# Altium schematic sheet stm32_mcu.SchDoc: STM32 Pin Out and Decoupling
size B; Author: Jonathan Lin; Engineer: Jonathan Lin; Revision: 1; SheetNumber: 3; SheetTotal: 3
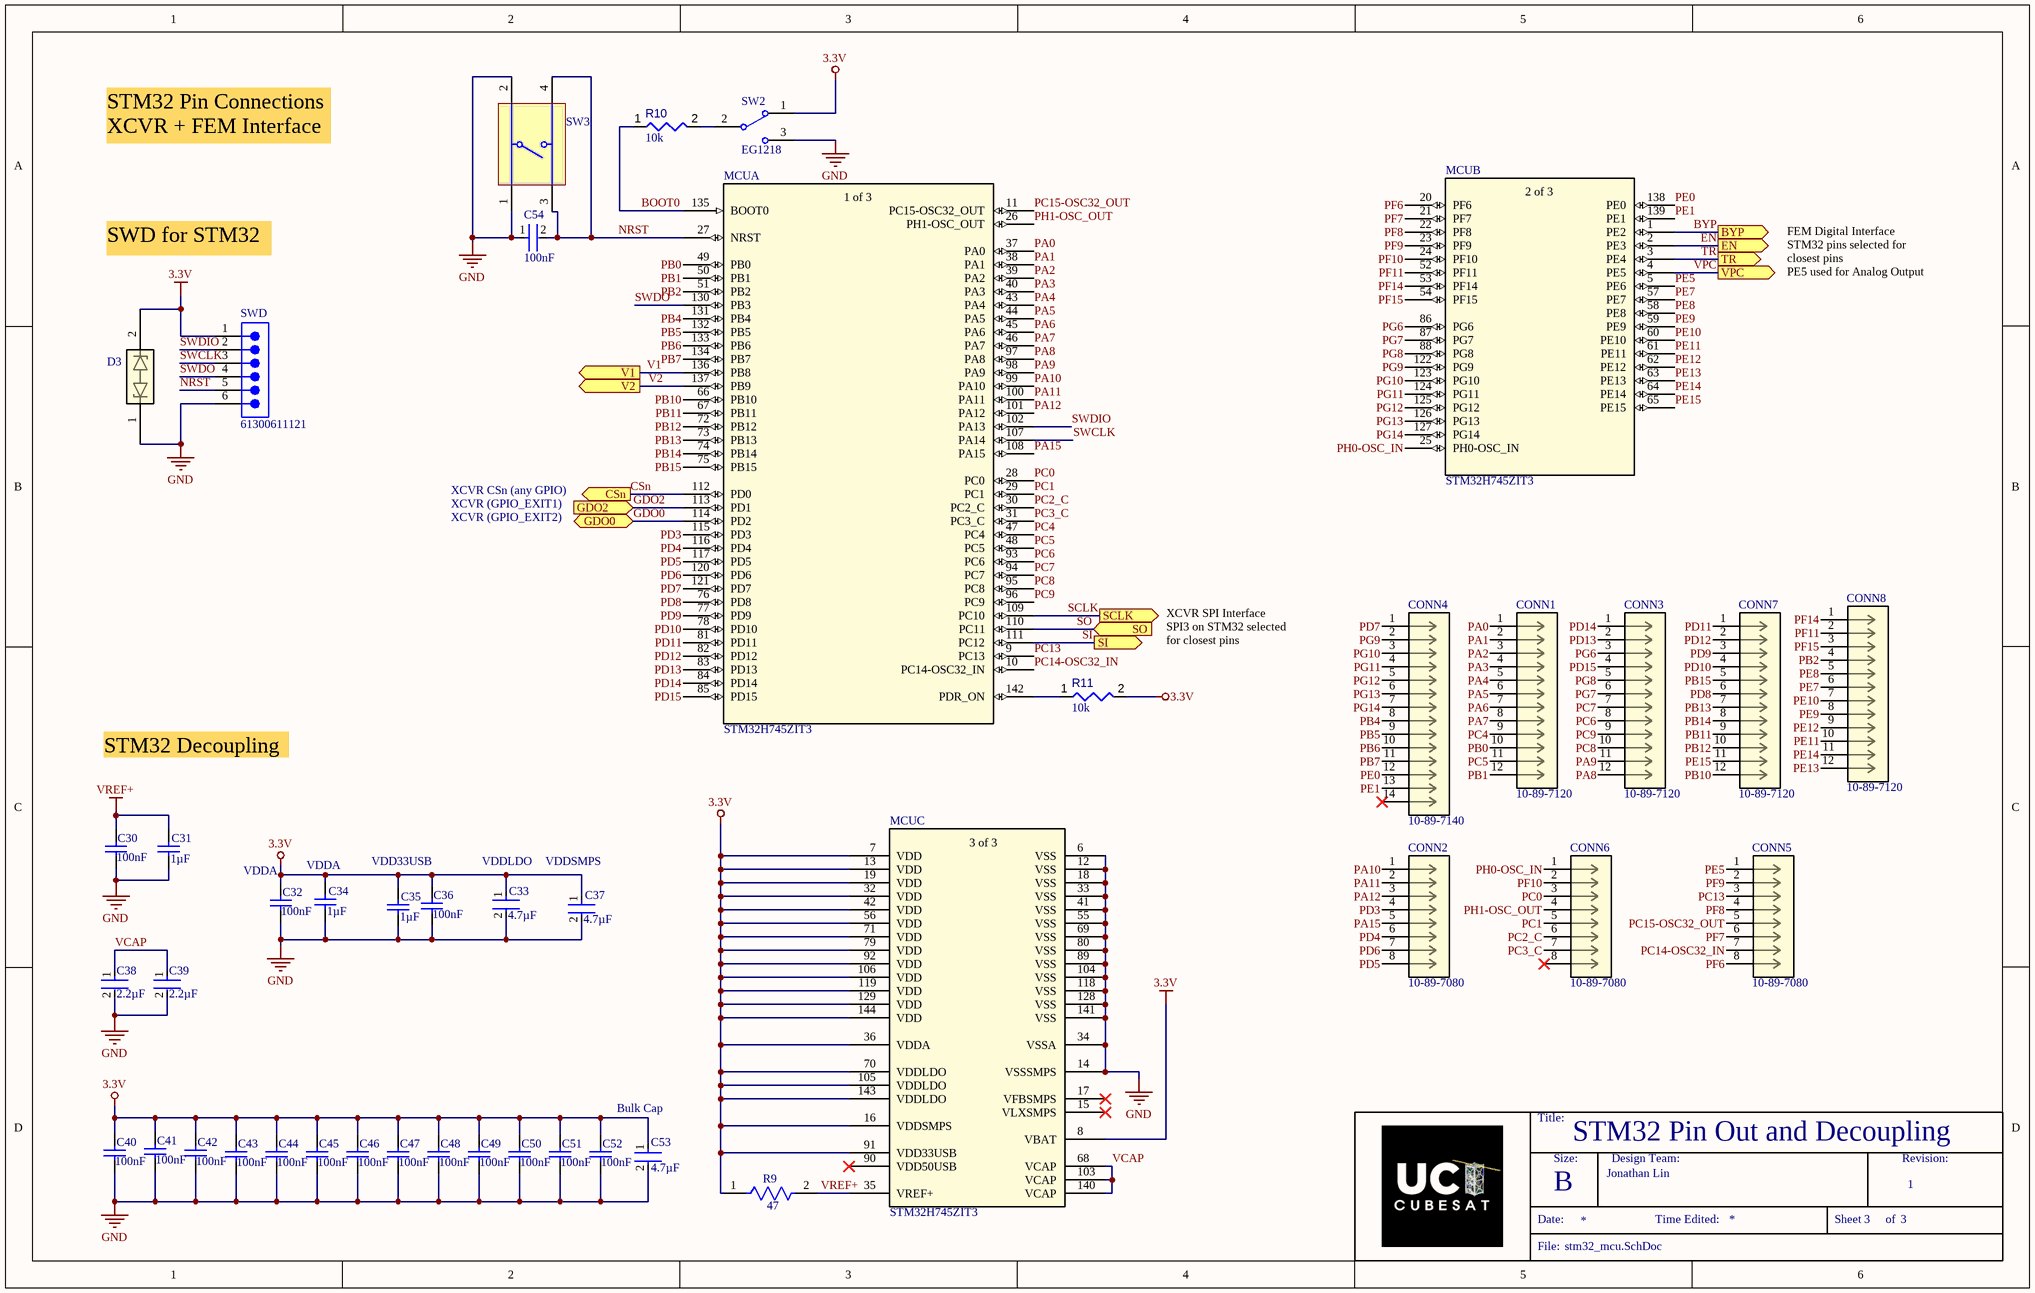
[diagram p0: stm32_mcu.SchDoc]

## Parts
C30  value 100nF  [CAPC2013X135X45ML10T25]  (hidden comment: GRM21BR72A104KAC4L)
C31  value 1µF  [CAPC2013X135X45LL10T25]  (hidden comment: GRM21BR71C105KA01L)
C32  value 100nF  [CAPC2013X135X45ML10T25]  (hidden comment: GRM21BR72A104KAC4L)
C33  value 4.7µF  [FP-GRM21B-0_2-e0_2_0_7-MFG]  (hidden comment: GRM21BZ7YA475KE15K)
C34  value 1µF  [CAPC2013X135X45LL10T25]  (hidden comment: GRM21BR71C105KA01L)
C35  value 1µF  [CAPC2013X135X45LL10T25]  (hidden comment: GRM21BR71C105KA01L)
C36  value 100nF  [CAPC2013X135X45ML10T25]  (hidden comment: GRM21BR72A104KAC4L)
C37  value 4.7µF  [FP-GRM21B-0_2-e0_2_0_7-MFG]  (hidden comment: GRM21BZ7YA475KE15K)
C38  value 2.2µF  [FP-GRM21B-0_15-IPC_A]  (hidden comment: GRM21BR71E225KE11L)
C39  value 2.2µF  [FP-GRM21B-0_15-IPC_A]  (hidden comment: GRM21BR71E225KE11L)
C40  value 100nF  [CAPC2013X135X45ML10T25]  (hidden comment: GRM21BR72A104KAC4L)
C41  value 100nF  [CAPC2013X135X45ML10T25]  (hidden comment: GRM21BR72A104KAC4L)
C42  value 100nF  [CAPC2013X135X45ML10T25]  (hidden comment: GRM21BR72A104KAC4L)
C43  value 100nF  [CAPC2013X135X45ML10T25]  (hidden comment: GRM21BR72A104KAC4L)
C44  value 100nF  [CAPC2013X135X45ML10T25]  (hidden comment: GRM21BR72A104KAC4L)
C45  value 100nF  [CAPC2013X135X45ML10T25]  (hidden comment: GRM21BR72A104KAC4L)
C46  value 100nF  [CAPC2013X135X45ML10T25]  (hidden comment: GRM21BR72A104KAC4L)
C47  value 100nF  [CAPC2013X135X45ML10T25]  (hidden comment: GRM21BR72A104KAC4L)
C48  value 100nF  [CAPC2013X135X45ML10T25]  (hidden comment: GRM21BR72A104KAC4L)
C49  value 100nF  [CAPC2013X135X45ML10T25]  (hidden comment: GRM21BR72A104KAC4L)
C50  value 100nF  [CAPC2013X135X45ML10T25]  (hidden comment: GRM21BR72A104KAC4L)
C51  value 100nF  [CAPC2013X135X45ML10T25]  (hidden comment: GRM21BR72A104KAC4L)
C52  value 100nF  [CAPC2013X135X45ML10T25]  (hidden comment: GRM21BR72A104KAC4L)
C53  value 4.7µF  [FP-GRM21B-0_2-e0_2_0_7-MFG]  (hidden comment: GRM21BZ7YA475KE15K)
C54  value 100nF  [FP-C0805C-DN-IPC_A]  (hidden comment: C0805C104K5RACTU)
CONN1  10-89-7120  [CONN12_0010897120_MOL]
CONN2  10-89-7080  [CONN08_0010897080_MOL]
CONN3  10-89-7120  [CONN12_0010897120_MOL]
CONN4  10-89-7140  [CONN14_0010897140_MOL]
CONN5  10-89-7080  [CONN08_0010897080_MOL]
CONN6  10-89-7080  [CONN08_0010897080_MOL]
CONN7  10-89-7120  [CONN12_0010897120_MOL]
CONN8  10-89-7120  [CONN12_0010897120_MOL]
D3  PESD3V3Z1BCSFYL  [SOD962-2_DSN0603-2_NEX]  (value not drawn)
MCU  STM32H745ZIT3  [LQFP-144]  (parts A,B,C of 3)
R9  value 47  [FP-RMCF1206-IPC_B]  (hidden comment: RMCF1206JT47R0)
R10  value 10k  [RESC3216X60X45ML15T20]  (hidden comment: RC0805FR-0710KL)
R11  value 10k  [RESC3216X60X45ML15T20]  (hidden comment: Resistor 10k +/-1% 1206 250 mW)
SW2  EG1218  [ESWI-EG1218_V]
SW3  1825910-6 Tact Switch  [TECO-1825910-6_V]  (value not drawn)
SWD  61300611121  [61300611121]

## Ports
BYP (out, see jlin_transceiver_prototype[2C]), CSn (out, see jlin_transceiver_prototype[1B]), EN (out, see jlin_transceiver_prototype[2C]), GDO0 (bidir, see jlin_transceiver_prototype[1B]), GDO2 (in, see jlin_transceiver_prototype[1B]), SCLK (out, see jlin_transceiver_prototype[1A]), SI (out, see jlin_transceiver_prototype[2A]), SO (in, see jlin_transceiver_prototype[1A]), TR (out, see jlin_transceiver_prototype[2C]), V1 (out, see jlin_transceiver_prototype[5A]), V2 (out, see jlin_transceiver_prototype[5A]), VPC (out, see jlin_transceiver_prototype[1C])

## Nets
3.3V: C32.2 C33.1 C34.2 C35.2 C36.2 C37.1 C40.2 C41.2 C42.2 C43.2 C44.2 C45.2 C46.2 C47.2 C48.2 C49.2 C50.2 C51.2 C52.2 C53.1 D3.2 MCU.7(VDD) MCU.8(VBAT) MCU.13(VDD) MCU.16(VDDSMPS) MCU.19(VDD) MCU.32(VDD) MCU.36(VDDA) MCU.42(VDD) MCU.56(VDD) MCU.70(VDDLDO) MCU.71(VDD) MCU.79(VDD) MCU.91(VDD33USB) MCU.92(VDD) MCU.105(VDDLDO) MCU.106(VDD) MCU.119(VDD) MCU.129(VDD) MCU.143(VDDLDO) MCU.144(VDD) R9.1 R11.2 SW2.1 SWD.1
GND: C30.1 C31.1 C32.1 C33.2 C34.1 C35.1 C36.1 C37.2 C38.2 C39.2 C40.1 C41.1 C42.1 C43.1 C44.1 C45.1 C46.1 C47.1 C48.1 C49.1 C50.1 C51.1 C52.1 C53.2 C54.1 D3.1 MCU.6(VSS) MCU.12(VSS) MCU.14(VSSSMPS) MCU.18(VSS) MCU.33(VSS) MCU.34(VSSA) MCU.41(VSS) MCU.55(VSS) MCU.69(VSS) MCU.80(VSS) MCU.89(VSS) MCU.104(VSS) MCU.118(VSS) MCU.128(VSS) MCU.141(VSS) SW2.3 SW3.1 SW3.2 SWD.6
VREF+: C30.2 C31.2 MCU.35(VREF+) R9.2
BOOT0: MCU.135(BOOT0) R10.1
BYP: MCU.1(PE2) ; port BYP
CSn: MCU.112(PD0) ; port CSn
EN: MCU.2(PE3) ; port EN
GDO0: MCU.114(PD2) ; port GDO0
GDO2: MCU.113(PD1) ; port GDO2
NRST: C54.2 MCU.27(NRST) SW3.3 SW3.4 SWD.5
PA0: CONN1.1 MCU.37(PA0)
PA1: CONN1.2 MCU.38(PA1)
PA2: CONN1.3 MCU.39(PA2)
PA3: CONN1.4 MCU.40(PA3)
PA4: CONN1.5 MCU.43(PA4)
PA5: CONN1.6 MCU.44(PA5)
PA6: CONN1.7 MCU.45(PA6)
PA7: CONN1.8 MCU.46(PA7)
PA8: CONN3.12 MCU.97(PA8)
PA9: CONN3.11 MCU.98(PA9)
PA10: CONN2.1 MCU.99(PA10)
PA11: CONN2.2 MCU.100(PA11)
PA12: CONN2.3 MCU.101(PA12)
PA15: CONN2.5 MCU.108(PA15)
PB0: CONN1.10 MCU.49(PB0)
PB1: CONN1.12 MCU.50(PB1)
PB2: CONN8.4 MCU.51(PB2)
PB4: CONN4.8 MCU.131(PB4)
PB5: CONN4.9 MCU.132(PB5)
PB6: CONN4.10 MCU.133(PB6)
PB7: CONN4.11 MCU.134(PB7)
PB10: CONN7.12 MCU.66(PB10)
PB11: CONN7.9 MCU.67(PB11)
PB12: CONN7.10 MCU.72(PB12)
PB13: CONN7.7 MCU.73(PB13)
PB14: CONN7.8 MCU.74(PB14)
PB15: CONN7.5 MCU.75(PB15)
PC0: CONN6.3 MCU.28(PC0)
PC1: CONN6.5 MCU.29(PC1)
PC2_C: CONN6.6 MCU.30(PC2_C)
PC3_C: CONN6.7 MCU.31(PC3_C)
PC4: CONN1.9 MCU.47(PC4)
PC5: CONN1.11 MCU.48(PC5)
PC6: CONN3.8 MCU.93(PC6)
PC7: CONN3.7 MCU.94(PC7)
PC8: CONN3.10 MCU.95(PC8)
PC9: CONN3.9 MCU.96(PC9)
PC13: CONN5.3 MCU.9(PC13)
PC14-OSC32_IN: CONN5.7 MCU.10(PC14-OSC32_IN)
PC15-OSC32_OUT: CONN5.5 MCU.11(PC15-OSC32_OUT)
PD3: CONN2.4 MCU.115(PD3)
PD4: CONN2.6 MCU.116(PD4)
PD5: CONN2.8 MCU.117(PD5)
PD6: CONN2.7 MCU.120(PD6)
PD7: CONN4.1 MCU.121(PD7)
PD8: CONN7.6 MCU.76(PD8)
PD9: CONN7.3 MCU.77(PD9)
PD10: CONN7.4 MCU.78(PD10)
PD11: CONN7.1 MCU.81(PD11)
PD12: CONN7.2 MCU.82(PD12)
PD13: CONN3.2 MCU.83(PD13)
PD14: CONN3.1 MCU.84(PD14)
PD15: CONN3.4 MCU.85(PD15)
PE0: CONN4.12 MCU.138(PE0)
PE1: CONN4.13 MCU.139(PE1)
PE5: CONN5.1 MCU.5(PE6)
PE7: CONN8.6 MCU.57(PE7)
PE8: CONN8.5 MCU.58(PE8)
PE9: CONN8.8 MCU.59(PE9)
PE10: CONN8.7 MCU.60(PE10)
PE11: CONN8.10 MCU.61(PE11)
PE12: CONN8.9 MCU.62(PE12)
PE13: CONN8.12 MCU.63(PE13)
PE14: CONN8.11 MCU.64(PE14)
PE15: CONN7.11 MCU.65(PE15)
PF6: CONN5.8 MCU.20(PF6)
PF7: CONN5.6 MCU.21(PF7)
PF8: CONN5.4 MCU.22(PF8)
PF9: CONN5.2 MCU.23(PF9)
PF10: CONN6.2 MCU.24(PF10)
PF11: CONN8.2 MCU.52(PF11)
PF14: CONN8.1 MCU.53(PF14)
PF15: CONN8.3 MCU.54(PF15)
PG6: CONN3.3 MCU.86(PG6)
PG7: CONN3.6 MCU.87(PG7)
PG8: CONN3.5 MCU.88(PG8)
PG9: CONN4.2 MCU.122(PG9)
PG10: CONN4.3 MCU.123(PG10)
PG11: CONN4.4 MCU.124(PG11)
PG12: CONN4.5 MCU.125(PG12)
PG13: CONN4.6 MCU.126(PG13)
PG14: CONN4.7 MCU.127(PG14)
PH0-OSC_IN: CONN6.1 MCU.25(PH0-OSC_IN)
PH1-OSC_OUT: CONN6.4 MCU.26(PH1-OSC_OUT)
SCLK: MCU.109(PC10) ; port SCLK
SI: MCU.111(PC12) ; port SI
SO: MCU.110(PC11) ; port SO
SWCLK: MCU.107(PA14) SWD.3
SWDIO: MCU.102(PA13) SWD.2
SWDO: MCU.130(PB3) SWD.4
TR: MCU.3(PE4) ; port TR
V1: MCU.136(PB8) ; port V1
V2: MCU.137(PB9) ; port V2
VCAP: C38.1 C39.1 MCU.68(VCAP) MCU.103(VCAP) MCU.140(VCAP)
VPC: MCU.4(PE5) ; port VPC
NetMCU_142: MCU.142(PDR_ON) R11.1
NetR10_2: R10.2 SW2.2(COM)

Not connected (* = marked no-connect by the designer): CONN4 14*; CONN6 8*; MCU 15(VLXSMPS)* 17(VFBSMPS)* 90(VDD50USB)*

## Notes on the sheet
- STM32 Pin Connections
  XCVR + FEM Interface
- SWD for STM32
- FEM Digital Interface
  STM32 pins selected for closest pins
  PE5 used for Analog Output
- XCVR CSn (any GPIO)
- XCVR (GPIO_EXIT1)
- XCVR (GPIO_EXIT2)
- XCVR SPI Interface
  SPI3 on STM32 selected for closest pins
- STM32 Decoupling
- (near C32) VDDA
- VDDA
- VDD33USB
- (near C33) VDDLDO
- VDDSMPS
- Bulk Cap
- Title:
- Size:
- Design Team:
- Revision:
- Date:
- B
- Time Edited:
- Sheet
- of
- File:
- (in symbol CMP-058-000001-2, part A) 1 of 3
- (in symbol CMP-058-000001-2, part B) 2 of 3
- (in symbol CMP-058-000001-2, part C) 3 of 3

## Library data of the parts
C30 C32 C36 C40-C52 = CMP-001-00124-1: Ceramic Capacitor, Multilayer, Ceramic, 100V, 10% +Tol, 10% -Tol, X7R, 15% TC, 0.1uF, Surface Mount, 0805; Multilayer: Yes; Capacitor Type: Ceramic; Width: 1.25mm; Tolerance (fill in as +-): 10%; Max Operating Temperature: 125°C; Package Style: SMTMeter; Termination: Wraparound; Packaging: Tape and Reel; Rated DC Voltage (URdc): 100V; Length: 2mm; Terminal Finish: Nickel; Min Operating Temperature: -55°C; Reach SVHC Compliant: Yes; JESD-609 Code: e3; RoHS Compliant: Yes; Tolerance  (fill in as +-): 10%; Temperature Characteristics Code: X7R; Pins: 2; Dielectric Material: Ceramic; Case/Package: 0805; Package Shape: Rectangular; Mounting Technology: Surface Mount; Height: 1.25mm
C31 C34 C35 = CMP-001-00129-1: Ceramic Capacitor, Multilayer, Ceramic, 16V, 10% +Tol, 10% -Tol, X7R, 15% TC, 1uF, Surface Mount, 0805; Multilayer: Yes; Length: 2mm; Terminal Finish: Nickel; RoHS Compliant: Yes; Packaging: Tape and Reel; Termination: Wraparound; Reach SVHC Compliant: Yes; Rated DC Voltage (URdc): 16V; Max Operating Temperature: 125°C; Dielectric Material: Ceramic; Tolerance (fill in as +-): 10%; Min Operating Temperature: -55°C; Package Style: SMTMeter; Case/Package: 0805; Height: 1.25mm; Temperature Characteristics Code: X7R; Capacitor Type: Ceramic; Mounting Technology: Surface Mount; Package Shape: Rectangular; Tolerance  (fill in as +-): 10%; JESD-609 Code: e3; Width: 1.25mm; Pins: 2
C33 C37 C53 = CMP-001-00127-1: Ceramic Capacitor, Multilayer, Ceramic, 35V, 10% +Tol, 10% -Tol, X7R, 15% TC, 4.7uF, Surface Mount, 0805; Multilayer: Yes; Pins: 2; Mounting Technology: Surface Mount; Dielectric Material: Ceramic; Tolerance (fill in as +-): 10%; Reach SVHC Compliant: Yes; Case/Package: 0805; Max Operating Temperature: 125°C; Termination: Wraparound; Min Operating Temperature: -55°C; RoHS Compliant: Yes; Terminal Finish: Nickel; Rated DC Voltage (URdc): 35V; Temperature Characteristics Code: X7R; Package Shape: Rectangular; Capacitor Type: Ceramic; JESD-609 Code: e3; Packaging: Tape and Reel; Tolerance  (fill in as +-): 10%
C38 C39 = CMP-001-00131-1: Ceramic Capacitor, Multilayer, Ceramic, 25V, 10% +Tol, 10% -Tol, X7R, 15% TC, 2.2uF, Surface Mount, 0805; Multilayer: Yes; Case/Package: 0805; Tolerance (fill in as +-): 10%; Max Operating Temperature: 125°C; Height: 1.25mm; Dielectric Material: Ceramic; Capacitor Type: Ceramic; Terminal Finish: Nickel; Tolerance  (fill in as +-): 10%; Package Shape: Rectangular; Length: 2mm; Packaging: Tape and Reel; RoHS Compliant: Yes; Termination: Wraparound; Temperature Characteristics Code: X7R; Package Style: SMTMeter; Pins: 2; Width: 1.25mm; JESD-609 Code: e3; Mounting Technology: Surface Mount; Rated DC Voltage (URdc): 25V; Min Operating Temperature: -55°C; Reach SVHC Compliant: Yes
C54 = CMP-001-00137-1: Ceramic Capacitor, Multilayer, Ceramic, 50V, 10% +Tol, 10% -Tol, X7R, 15% TC, 0.1uF, Surface Mount, 0805; Multilayer: Yes; Termination: Wraparound; Capacitor Type: Ceramic; Rated DC Voltage (URdc): 50V; Package Style: SMTMeter; Pins: 2; Mounting Technology: Surface Mount; Terminal Finish: Nickel; Length: 2mm; Tolerance (fill in as +-): 10%; Max Operating Temperature: 125°C; RoHS Compliant: Yes; Height: 0.78mm; Case/Package: 0805; JESD-609 Code: e3; Packaging: Tape and Reel; Dielectric Material: Ceramic; Temperature Characteristics Code: X7R; Min Operating Temperature: -55°C; Reach SVHC Compliant: Yes; Tolerance  (fill in as +-): 10%; Width: 1.25mm; Package Shape: Rectangular
CONN1 CONN3 CONN7 CONN8 = CMP-002-00074-3: Board Connector, 12 Contact(s), 2 Row(s), Male, Straight, 0.1 inch Pitch, Solder Terminal, Locking, Black Insulator, Receptacle; Manufacturer Series: 70280; Reference Standard: UL; Durability: 50Cycles; Dielectric Withstanding Voltage (AC): 600V; Contact Pattern: RECTANGULAR; Mixed Contacts: No; Body Breadth: 0.2inch; Number of Rows Loaded: 2; Reliability: COMMERCIAL; Mating Information: MULTIPLE MATING PARTS AVAILABLE; Insulation Resistance: 1GR; PCB Contact Row Spacing: 2.54mm; Contact Style: SQ PIN-SKT; Body Depth: 0.09inch; Body Length: 0.6inch; Option: General Purpose; Plating Thickness: 30uin; Number Of Connectors: 1; Number of Contacts: 12; Rated Current (Signal): 3A; Flammability Rating: UL94 V-0; Mounting Style: STRAIGHT; Contact Finish - Mating: GOLD (30) OVER NICKEL; Contact Material: Bronze; Termination: Solder; Terminal Length: 0.107inch; Contact Finish - Termination: TIN (75) OVER NICKEL; IEC Conformance: No; Connector Type: BOARD CONNECTOR; Reach SVHC Compliant: Yes; Insulation Material: Polymer; Body/Shell Style: RECEPTACLE; Mounting Technology: Board; Mounting Option 1: LOCKING; Number Of PCB Rows: 2; PCB Contact Pattern: RECTANGULAR; Mating Contact Pitch: 0.1inch; JESD-609 Code: e3; Max Operating Temperature: 120°C; RoHS Compliant: Yes; MIL Conformance: No; Insulation Color: Black; Mating Contact Row Spacing: 0.1inch; Min Operating Temperature: -40°C; DIN Conformance: No; Filter Feature: No; Contact Gender: Male; Terminal Pitch: 2.54mm
CONN2 CONN5 CONN6 = CMP-002-00075-2: Board Connector, 8 Contact(s), 2 Row(s), Male, Straight, 0.1 inch Pitch, Solder Terminal, Receptacle; DIN Conformance: No; Rated Current (Signal): 3A; Mating Information: MULTIPLE MATING PARTS AVAILABLE; Number Of Connectors: 1; Number of Rows Loaded: 2; Reference Standard: UL; Durability: 50Cycles; Contact Pattern: RECTANGULAR; Contact Style: SQ PIN-SKT; Insulation Resistance: 1GR; Body Depth: 0.09inch; Plating Thickness: 30uin; Reliability: COMMERCIAL; Body Breadth: 0.2inch; Option: General Purpose; Polarization Key: POLAR PIN POSITION; Number of Contacts: 8; Dielectric Withstanding Voltage (DC): 600V; PCB Contact Row Spacing: 2.54mm; Contact Resistance: 15mR; Body Length: 0.39inch; Mating Contact Row Spacing: 0.1inch; Flammability Rating: UL94 V-0; Number Of PCB Rows: 2; IEC Conformance: No; RoHS Compliant: Yes; Mixed Contacts: No; Mating Contact Pitch: 0.1inch; Reach SVHC Compliant: Yes; Contact Gender: Male; PCB Contact Pattern: RECTANGULAR; Body/Shell Style: RECEPTACLE; Max Operating Temperature: 105°C; Contact Material: Bronze; Termination: Solder; Terminal Pitch: 2.54mm; Min Operating Temperature: -40°C; Insulation Material: Thermoplastic; Connector Type: BOARD CONNECTOR; Mounting Style: STRAIGHT; Mounting Technology: Board; Filter Feature: No; JESD-609 Code: e3; Terminal Length: 0.11inch; Contact Finish - Mating: GOLD (30) OVER NICKEL; Contact Finish - Termination: Tin (Sn) - with Nickel (Ni) barrier; MIL Conformance: No
CONN4 = CMP-002-00076-2: Board Connector, 14 Contact(s), 2 Row(s), Male, Straight, 0.1 inch Pitch, Solder Terminal, Locking, Black Insulator, Receptacle; Manufacturer Series: 70280; Durability: 50Cycles; Dielectric Withstanding Voltage (AC): 600V; Reliability: COMMERCIAL; Number Of PCB Rows: 2; PCB Contact Pattern: RECTANGULAR; Body Depth: 0.09inch; Mating Information: MULTIPLE MATING PARTS AVAILABLE; Rated Current (Signal): 3A; DIN Conformance: No; Plating Thickness: 30uin; Body Length: 0.7inch; Contact Style: SQ PIN-SKT; Option: General Purpose; Number of Contacts: 14; Reference Standard: UL; PCB Contact Row Spacing: 2.54mm; Insulation Resistance: 1GR; Body Breadth: 0.2inch; Number Of Connectors: 1; Contact Gender: Male; Insulation Color: Black; Mating Contact Pitch: 0.1inch; Contact Material: Bronze; Max Operating Temperature: 120°C; Contact Pattern: RECTANGULAR; Mating Contact Row Spacing: 0.1inch; Mounting Technology: Board; Body/Shell Style: RECEPTACLE; Min Operating Temperature: -40°C; Reach SVHC Compliant: Yes; RoHS Compliant: Yes; Termination: Solder; Filter Feature: No; Mounting Style: STRAIGHT; Contact Finish - Mating: GOLD (30) OVER NICKEL; Terminal Length: 0.107inch; Connector Type: BOARD CONNECTOR; Flammability Rating: UL94 V-0; JESD-609 Code: e3; Mixed Contacts: No; Contact Finish - Termination: TIN (75) OVER NICKEL; IEC Conformance: No; MIL Conformance: No; Mounting Option 1: LOCKING; Insulation Material: Polymer; Terminal Pitch: 2.54mm; Number of Rows Loaded: 2
D3 = CMP-004-00036-1: PESD3V3Zxx: 6.8 V 15 A 0.45 pF Bidirectional ESD Protection Diode - DSN0603-2
MCU = CMP-058-000001-2: No Description Available; Mfr_Name: STMicroelectronics; Design Item ID: STM32H745ZIT3; Type: Type; RefDes: RefDes; Source: STM32H745ZIT3.SchLib
R9 = CMP-009-00201-1: Fixed Resistor, Metal Glaze/thick Film, 0.25W, 47ohm, 200V, 5% +/-Tol, 200ppm/Cel, Surface Mount, 1206; Package Length: 3.2mm; Rated Temperature: 70°C; Power: 250mW; Package Height: 0.55mm; Package Width: 1.6mm; Temperature Coefficient (ppm/Cel): 200; Reference Standard: AEC-Q200; Resistor Type: FIXED RESISTOR; Packaging: Tape and Reel; Terminal Finish: Nickel; Working Voltage: 200V; Mounting Technology: Surface Mount; Package Shape: Rectangular; Technology: METAL GLAZE/THICK FILM; RoHS Compliant: Yes; Min Operating Temperature: -55°C; JESD-609 Code: e3; Tolerance: 5%; Pins: 2; Case/Package: 1206; Construction: Rectangular; Termination: Wraparound; Reach SVHC Compliant: Yes; Max Operating Temperature: 155°C
R10 = CMP-009-00016-5: Chip Resistor, 10 KOhm, +/- 1%, 0.25 W, -55 to 155 degC, 1206 (3216 Metric) / Resistor 10k +/-1% 1206 250 mW / RC0805FR-0710KL; Power: 250mW; Voltage Rating: 200V; Pins: 2; Max Operating Temperature: 155°C; Tolerance: 1%; RoHS Compliant: True; Case/Package: 1206; Min Operating Temperature: -55°C; Mounting Technology: SM
R11 = CMP-009-00016-5: Chip Resistor, 10 KOhm, +/- 1%, 0.25 W, -55 to 155 degC, 1206 (3216 Metric); Power: 250mW; Voltage Rating: 200V; Pins: 2; Max Operating Temperature: 155°C; Tolerance: 1%; RoHS Compliant: True; Case/Package: 1206; Min Operating Temperature: -55°C; Mounting Technology: SM
SW2 = CMP-011-00006-2: Slide Switch, SPDT, 500 V, -20 to 70 degC, 3-Pin THD, RoHS, Bulk; Manufacturer: E-Switch; Voltage Rating (DC): 30V; Current Rating: 200mA; Operating Force: 250gf; Package Quantity: 1000; Contact Plating: Silver; Max Operating Temperature: 70°C; Min Operating Temperature: -20°C; Contact Material: Copper; Datasheet URL: https://www.e-switch.com/system/asset/product_line/data_sheet/119/EG.pdf; Contact Finish: Silver; Case/Package: EG1218; Voltage Rating (AC): 30V; Datasheet Version: Oct-15; Package Description: 3-Pin Through Hole Device, Body 11.6 x 4 mm, Pitch 2.5 mm; RoHS Compliant: True; Package Reference: EG1218; Manufacturer URL: http://www.e-switch.ch/en/; Throw Configuration: SPDT; Contact Current Rating: 200mA; Mounting Technology: TH; Packaging: Bulk; Pins: 3
SW3 = CMP-011-00013-1: Keypad Switch, 1 Switches, SPST, Momentary-tactile, 0.05A, 24VDC, 2.06N, 4 PCB Hole Cnt, Solder Terminal, Through Hole-straight; Contact Current(DC)-Max: 50mA; Body Breadth: 5.99mm; Contact Voltage(DC)-Max: 24V; Body Height: 3.61mm; Number of Switches: 1; Circuit Configuration: 1X1; Contact DC Max Rating R Load: .05A@24VDC; Mounting Technology: Through Hole; Reach SVHC Compliant: Yes; Max Operating Temperature: 85°C; Switch Action: MOMENTARY; Switch Type: Keypad; Min Operating Temperature: -35°C; Operating Force-Max: 2.06N; Switch Function: SPST; RoHS Compliant: Yes; Termination: Solder; Body Length or Diameter: 5.99mm
SWD = CMP-002-00073-1: Board Connector, 6 Contact(s), 1 Row(s), Male, Straight, 0.1 inch Pitch, Solder Terminal, Locking, Black Insulator, Plug for STM32 interface; Number of Rows Loaded: 1; Dielectric Withstanding Voltage (AC): 500V; Reliability: COMMERCIAL; Body Length: 0.6inch; Rated Current (Signal): 3A; Contact Style: SQ PIN-SKT; Reference Standard: UL; Number of Contacts: 6; Insulation Resistance: 1GR; PCB Contact Pattern: RECTANGULAR; Contact Resistance: 20mR; Terminal Pitch: 2.54mm; Body Depth: 0.1inch; Body/Shell Style: PLUG; RoHS Compliant: Yes; Number Of Connectors: 1; Max Operating Temperature: 125°C; Contact Material: Copper Alloy; Mounting Option 1: LOCKING; Min Operating Temperature: -40°C; Mounting Technology: Board; Mating Contact Pitch: 0.1inch; Body Breadth: 0.1inch; Insulation Color: Black; Termination: Solder; Reach SVHC Compliant: Yes; Contact Gender: Male; JESD-609 Code: e4; Contact Finish - Termination: Gold (Au) - with Nickel (Ni) barrier; Contact Finish - Mating: GOLD; Connector Type: BOARD CONNECTOR; Mounting Style: STRAIGHT; Terminal Length: 0.118inch; Contact Pattern: RECTANGULAR; Insulation Material: Polybutylene